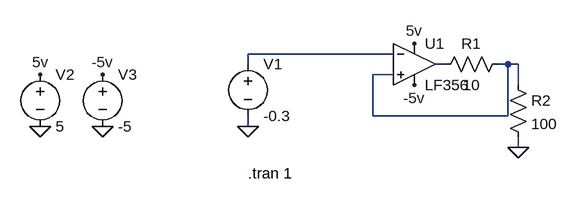
[diagram p0: schematic OpampTest.asc]
OpampTest.asc, the LTspice schematic file:
Version 4
SHEET 1 880 680
WIRE 208 144 -16 144
WIRE -16 160 -16 144
WIRE 288 160 272 160
WIRE 384 160 368 160
WIRE 400 160 384 160
WIRE 208 176 176 176
WIRE 400 192 400 160
WIRE 176 240 176 176
WIRE 384 240 384 160
WIRE 384 240 176 240
WIRE -16 256 -16 240
WIRE 400 288 400 272
FLAG -16 256 0
FLAG -336 256 0
FLAG -240 256 0
FLAG -336 176 5v
FLAG 240 128 5v
FLAG -240 176 -5v
FLAG 240 192 -5v
FLAG 400 288 0
SYMBOL LF356 240 96 R0
SYMATTR InstName U1
SYMBOL voltage -16 144 R0
WINDOW 123 0 0 Left 0
WINDOW 39 0 0 Left 0
SYMATTR InstName V1
SYMATTR Value -0.3
SYMBOL voltage -336 160 R0
WINDOW 123 0 0 Left 0
WINDOW 39 0 0 Left 0
SYMATTR InstName V2
SYMATTR Value 5
SYMBOL voltage -240 160 R0
WINDOW 123 0 0 Left 0
WINDOW 39 0 0 Left 0
SYMATTR InstName V3
SYMATTR Value -5
SYMBOL res 384 144 R90
WINDOW 0 0 56 VBottom 2
WINDOW 3 32 56 VTop 2
SYMATTR InstName R1
SYMATTR Value 10
SYMBOL res 384 176 R0
SYMATTR InstName R2
SYMATTR Value 100
TEXT -16 328 Left 2 !.tran 1

The netlist it stands for:
* OpampTest.asc
XU1 N003 N001 5v -5v N002 LF356  ; pins In+ In- V+ V- OUT
V1 N001 0 -0.3
V2 5v 0 5
V3 -5v 0 -5
R1 N003 N002 10
R2 N003 0 100
.tran 1
.lib LF356.sub
.backanno
.end